# Altium schematic sheet Check_Laser.SchDoc
size 420 x 297 mm
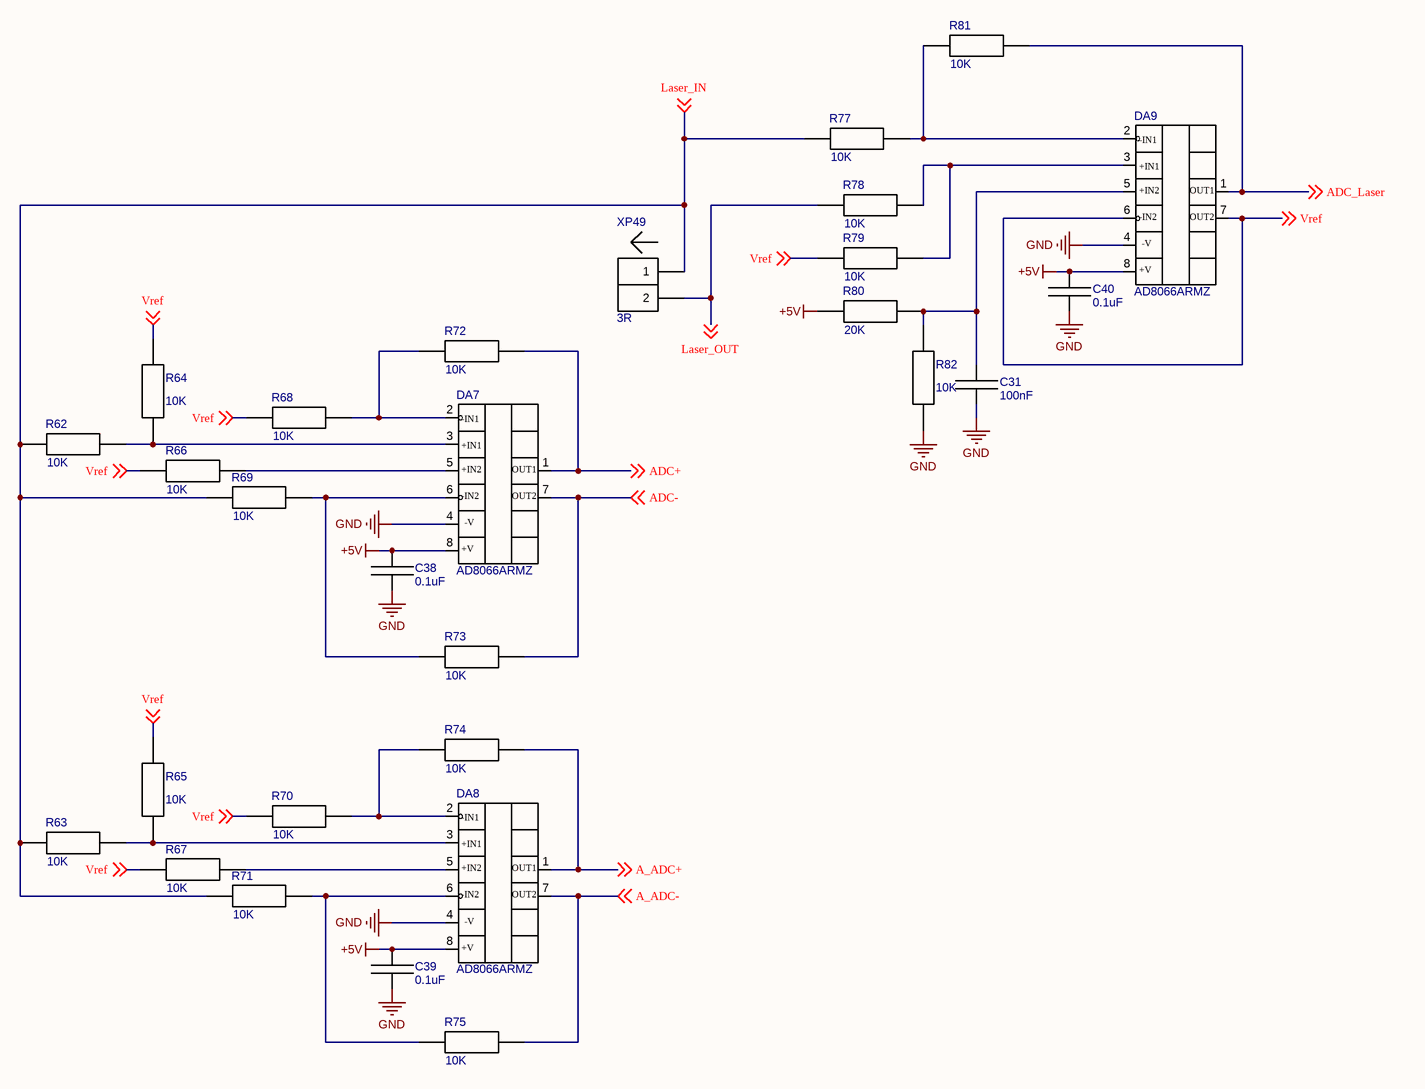
[diagram p0: Check_Laser.SchDoc]

## Parts
C31  100nF  [0402C]
C38  0.1uF  [0603C]
C39  0.1uF  [0603C]
C40  0.1uF  [0603C]
DA7  AD8066ARMZ  [MSOP-8]
DA8  AD8066ARMZ  [MSOP-8]
DA9  AD8066ARMZ  [MSOP-8]
R62  10K  [R0402]
R63  10K  [R0402]
R64  10K  [R0402]
R65  10K  [R0402]
R66  10K  [R0402]
R67  10K  [R0402]
R68  10K  [R0402]
R69  10K  [R0402]
R70  10K  [R0402]
R71  10K  [R0402]
R72  10K  [R0402]
R73  10K  [R0402]
R74  10K  [R0402]
R75  10K  [R0402]
R77  10K  [R0402]
R78  10K  [R0402]
R79  10K  [R0402]
R80  20K  [R0402]
R81  10K  [R0402]
R82  10K  [R0402]
XP49  3R  [PLS-2]

## Nets
+5V: C38.1 C39.1 C40.1 DA7.8(+VS) DA8.8(+VS) DA9.8(+VS) R80.1
GND: C31.1 C38.2 C39.2 C40.2 DA7.4(-VS) DA8.4(-VS) DA9.4(-VS) R82.1
A_ADC+: DA8.1(VOUT) R74.2 ; off-sheet A_ADC+
A_ADC-: DA8.7(VOUT2) R75.2 ; off-sheet A_ADC-
ADC+: DA7.1(VOUT) R72.2 ; off-sheet ADC+
ADC-: DA7.7(VOUT2) R73.2 ; off-sheet ADC-
ADC_Laser: DA9.1(VOUT) R81.2 ; off-sheet ADC_Laser
Laser_IN: R62.1 R63.1 R69.1 R71.1 R77.1 XP49.1 ; off-sheet Laser_IN
Laser_OUT: R78.1 XP49.2 ; off-sheet Laser_OUT
Vref: DA9.6(-IN2) DA9.7(VOUT2) R64.2 R65.2 R66.2 R67.2 R68.2 R70.2 R79.2 ; off-sheet Vref
NetC31_2: C31.2 DA9.5(+IN2) R80.2 R82.2
NetDA7_2: DA7.2(-IN1) R68.1 R72.1
NetDA7_3: DA7.3(+IN1) R62.2 R64.1
NetDA7_5: DA7.5(+IN2) R66.1
NetDA7_6: DA7.6(-IN2) R69.2 R73.1
NetDA8_2: DA8.2(-IN1) R70.1 R74.1
NetDA8_3: DA8.3(+IN1) R63.2 R65.1
NetDA8_5: DA8.5(+IN2) R67.1
NetDA8_6: DA8.6(-IN2) R71.2 R75.1
NetDA9_2: DA9.2(-IN1) R77.2 R81.1
NetDA9_3: DA9.3(+IN1) R78.2 R79.1

## Notes on the sheet
- Подп. и дата
- Инв.№ дубл.
- Взам.инв.№
- Подп.и дата
- Инв.№ подл.
- Изм.
- Лист
- № докум.
- Подп.
- Дата
- Формат  A3
- (in symbol AD8066ARMZ) OUT1; OUT2; -V; +V

## Library data of the parts
C31 = C0402-100nF 10% 50V: Part Number: SMD CAP CER 100nF ±10% 50V X5R 0402; Added_by: Rutel@Mail.ru; Solder_Amount: 2; Pkg: 0402; Created_at: 27/03/2020; MountType: SMD; Mount: MOUNT
C38-C40 = C0603-0.1UF 10% 50V: C0603 0.1UF 10% 50V; Part Number: SMD CAP CER 0.1UF ±10% 50V X7R 0603; Added_by: anton@teslatec.ru; Solder_Amount: 2; Pkg: 0603; Created_at: 10/01/2023; MountType: SMD; Mount: MOUNT
DA7-DA9 = AD8066ARMZ: High Performance, 145 MHz FastFET Op Amps; Added_by: irdolgopolowa@yandex.ru; Solder_Amount: 8; Created_at: 29/10/24; Mount: MOUNT; MountType: SMD; Pkg: MSOP-8; Part Number: AD8066ARMZ
R62-R75 R77-R79 R81 R82 = R0402-10K: Resistor SMD 10K 1% 0402; Part Number: SMD RES 10 KOHM 1% ±100ppm/°C 0402; Added_by: Rutel@teslatec.ru; Solder_Amount: 2; Pkg: 0402; Created_at: 21/04/2020; MountType: SMD; Mount: MOUNT
R80 = R0402-20K: Resistor SMD 20K 1% 0402; Part Number: SMD RES 20 KOHM 1% ±100ppm/°C 0402; Added_by: Rutel@teslatec.ru; Solder_Amount: 2; Pkg: 0402; Created_at: 21/04/2020; MountType: SMD; Mount: MOUNT
XP49 = PLS-2_Laser: KNP300JB-52-3R; Added_by: irdolgopolowa@yandex.ru; Solder_Amount: 2; Created_at: 29/10/24; Mount: MOUNT; MountType: THM; Part Number: PLS-2; Pkg: PLS-2; Mating Part: KNP300JB-52-3R